# EAGLE design PiPowerRF (EAGLE 7.2.0)
CNAME: PiCrusts; CREVISION: 1.0; DESIGNER: Prajwal Bhattaram
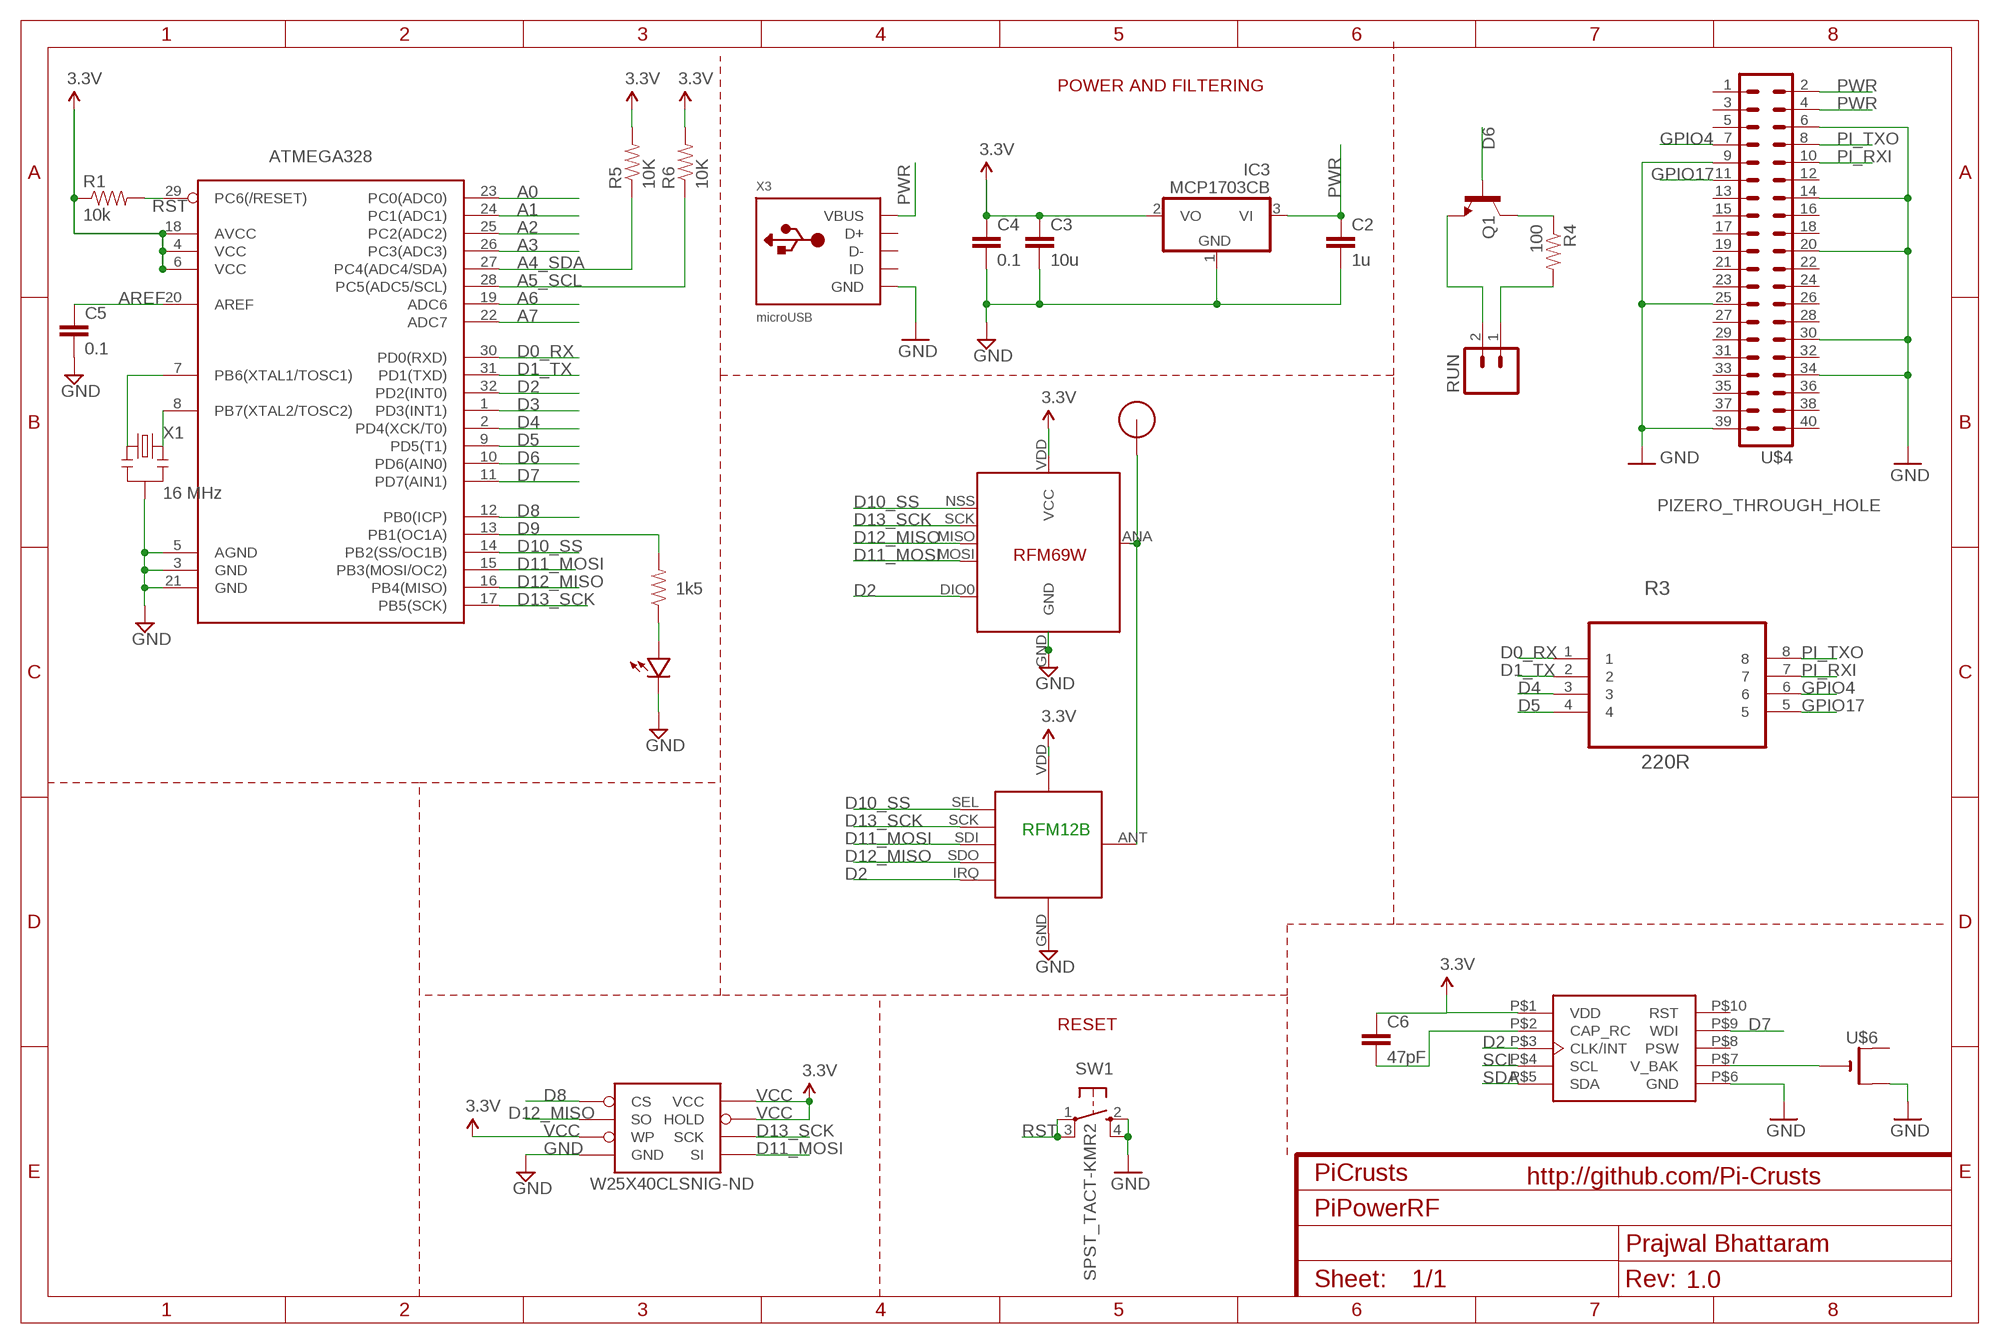
[diagram p0: schematic, sheet 1]

## Parts
ATMEGA328  ATMega-328  ATMEGA168/328TQFP32  [TQFP32-08]
C2  1u  CAP0603-CAP  [0603-CAP]
C3  10u  CAP0805-CAP  [0805-CAP]
C4  0.1  CAP0603-CAP  [0603-CAP]
C5  0.1  CAP0603-CAP  [0603-CAP]
C6  47pF  CAP0402-CAP  [0402-CAP]
IC3  MCP1703CB  [SOT23]
Q1  MMBT2222A  TRANSISTOR_NPNMMBT2222A  [SOT23-3]
R1  10k  RESISTOR0603-RES  [0603-RES]
R2  1k5  RESISTOR0603-RES  [0603-RES]
R3  220R  EXB38V221JV  [RESCAXE80P320X160X60-8N]
R4  100  RESISTOR0402-RES  [0402-RES]
R5  10K  RESISTOR0603  [0603-RES]
R6  10K  RESISTOR0603  [0603-RES]
RFM12B  RFM12B_MINPADS  [RFM12B-MINPADS]
RUN  M021X02_NO_SILK  [1X02_NO_SILK]
SW1  SPST_TACT-KMR2  [KMR2]
U$1  RFM12B_ANTENNA  [RFM12B-ANTENNA]
U$2  LED0603  [0603-LED]
U$4  PIZERO_THROUGH_HOLE  [PIZERO_THOUGH_HOLE]
U$5  RFM69  [RFM69W-MINPADS]
U$6  CR1220SMT  [CR1220-SMD]
W25X40CLSNIG-ND  AT25F512BWIDE_5.3MM  [SO08WIDE]
X1  16 MHz  RESONATORSMD  [RESONATOR-SMD]
X2  MC-RTC-RV-1805-C3-I2C  [MC-RTC-C3]
X3  microUSB  USB_MICRO_20329_V2  [4UCONN_20329_V2]

## Nets
A0: ATMEGA328.23(PC0(ADC0))
A1: ATMEGA328.24(PC1(ADC1))
A2: ATMEGA328.25(PC2(ADC2))
A3: ATMEGA328.26(PC3(ADC3))
A4_SDA: ATMEGA328.27(PC4(ADC4/SDA)) R5.1
A5_SCL: ATMEGA328.28(PC5(ADC5/SCL)) R6.1
A6: ATMEGA328.19(ADC6)
A7: ATMEGA328.22(ADC7)
AREF: ATMEGA328.20(AREF) C5.1
D0_RX: ATMEGA328.30(PD0(RXD)) R3.1
D1_TX: ATMEGA328.31(PD1(TXD)) R3.2
D2: ATMEGA328.32(PD2(INT0)) RFM12B.IRQ U$5.DIO0 X2.P$3(CLK/INT)
D3: ATMEGA328.1(PD3(INT1))
D4: ATMEGA328.2(PD4(XCK/T0)) R3.3
D5: ATMEGA328.9(PD5(T1)) R3.4
D6: ATMEGA328.10(PD6(AIN0)) Q1.1(B)
D7: ATMEGA328.11(PD7(AIN1)) X2.P$9(WDI)
D8: ATMEGA328.12(PB0(ICP)) W25X40CLSNIG-ND.1(CS)
D9: ATMEGA328.13(PB1(OC1A)) R2.2
D10_SS: ATMEGA328.14(PB2(SS/OC1B)) RFM12B.SEL U$5.NSS(SEL)
D11_MOSI: ATMEGA328.15(PB3(MOSI/OC2)) RFM12B.SDI(SDI/MOSI) U$5.MOSI W25X40CLSNIG-ND.5(SI)
D12_MISO: ATMEGA328.16(PB4(MISO)) RFM12B.SDO(SDO/MISO) U$5.MISO W25X40CLSNIG-ND.2(SO)
D13_SCK: ATMEGA328.17(PB5(SCK)) RFM12B.SCK U$5.SCK W25X40CLSNIG-ND.6(SCK)
GND [power]: ATMEGA328.3(GND) ATMEGA328.5(AGND) ATMEGA328.21(GND) C2.2 C3.2 C4.2 C5.2 IC3.1(GND) RFM12B.GND SW1.2(S) SW1.4(S1) U$2.MINUS U$4.6 U$4.9 U$4.14 U$4.20 U$4.25 U$4.30 U$4.34 U$4.39 U$5.GND U$6.+$2(+1) W25X40CLSNIG-ND.4(GND) X1.2 X2.P$6(GND) X3.BASE@1(GND) X3.BASE@2(GND) X3.GND X3.SPRT@1(GND) X3.SPRT@2(GND) X3.SPRT@3(GND) X3.SPRT@4(GND)
GPIO4: R3.6 U$4.7
GPIO17: R3.5 U$4.11
N$1: ATMEGA328.7(PB6(XTAL1/TOSC1)) X1.1
N$2: R2.1 U$2.PLUS
N$3: RFM12B.ANT U$1.P$1 U$5.ANA(ANT)
N$4: R4.2 RUN.1
N$5: Q1.2(E) RUN.2
N$6: U$6.- X2.P$7(V_BAK)
N$7: Q1.3(C) R4.1
N$8: C6.2 X2.P$2(CAP_RC)
N$21: ATMEGA328.8(PB7(XTAL2/TOSC2)) X1.3
PI_RXI: R3.7 U$4.10
PI_TXO: R3.8 U$4.8
PWR [power]: C2.1 IC3.3(VI) U$4.2 U$4.4 X3.VBUS
RST: ATMEGA328.29(PC6(/RESET)) R1.2 SW1.1(P) SW1.3(P1)
SCL: X2.P$4(SCL)
SDA: X2.P$5(SDA)
VCC: ATMEGA328.4(VCC) ATMEGA328.6(VCC) ATMEGA328.18(AVCC) C3.1 C4.1 C6.1 IC3.2(VO) R1.1 R5.2 R6.2 RFM12B.VDD U$5.VDD(VCC) W25X40CLSNIG-ND.3(WP) W25X40CLSNIG-ND.7(HOLD) W25X40CLSNIG-ND.8(VCC) X2.P$1(VDD) ; supply symbol labelled 3.3V
Unconnected: U$4.1 U$4.3 U$4.5 U$4.12 U$4.13 U$4.15 U$4.16 U$4.17 U$4.18 U$4.19 U$4.21 U$4.22 U$4.23 U$4.24 U$4.26 U$4.27 U$4.28 U$4.29 U$4.31 U$4.32 U$4.33 U$4.35 U$4.36 U$4.37 U$4.38 U$4.40 U$6.+$1(+) X2.P$8(PSW) X2.P$10(RST) X3.D+ X3.D- X3.ID

## Notes on the sheet
- POWER AND FILTERING
- RFM12B
- RESET
- http://github.com/Pi-Crusts

## Library data of the parts
ATMEGA328 = LowPowerLab:ATMEGA168/328: Atmel 32-pin 8-bit micro, 16k flash.
C2-C5 = LowPowerLab:CAP: Capacitor Standard 0603 ceramic capacitor, and 0.1" leaded capacitor.
C6 = SparkFun-Capacitors:CAP: Capacitor Standard 0603 ceramic capacitor, and 0.1" leaded capacitor.
IC3 = linear:MCP1703: 250 mA, 16V, Low Quiescent Current LDO Regulator Source: http://ww1.microchip.com/downloads/en/DeviceDoc/22049b.pdf
Q1 = SparkFun-DiscreteSemi:TRANSISTOR_NPN: Generic NPN BJT MMBT2222A - TRANS-08049 (SOT-23, 1A 40V) MPSA42 - TRANS-09116 (SOT-23, 500mA 300V) MMBT5088LT1G - TRANS-11160 (SOT-23, 50 mA 30V); PROD_ID: TRANS-08049
R1 R2 = LowPowerLab:RESISTOR: Resistor Basic schematic elements and footprints for 0603, 1206, and PTH resistors.
R3 = Panasonic-EXB-ERJ:EXB38V: Chip Resistor Array; MPN: EXB38V221JV; OC_FARNELL: 2060094; OC_NEWARK: 65T9093; PACKAGE: 0603; POWERRATING: 0.063 W/element; SUPPLIER: PANASONIC; TOLERANCE: ±5 %
R4 = SparkFun-Passives:RESISTOR: Resistor Basic schematic elements and footprints for 0603, 1206, and PTH resistors.
R5 R6 = SparkFun-Resistors:RESISTOR: Resistor Basic schematic elements and footprints for 0603, 1206, and PTH resistors.
RFM12B = LowPowerLab:RFM12B_MINPADS
RUN = SparkFun-Connectors:M02: Standard 2-pin 0.1" header. Use with - straight break away headers ( PRT-00116) - right angle break away headers (PRT-00553) - swiss pins (PRT-00743) - machine pins (PRT-00117) - female headers (PRT-00115) Molex polarized connector foot print use with: PRT-08233 with associated crimp pins and housings. 2.54_SCREWTERM for use with PRT-10571. 3.5mm Screw Terminal footprints for PRT-08084 5mm Screw Terminal footprints for use with PRT-08433
SW1 = adafruit:SPST_TACT: SMT 6mm switch, EVQQ2 series http://www.ladyada.net/library/eagle
U$1 = LowPowerLab:RFM12B_ANTENNA
U$2 = LowPowerLab:LED
U$4 = pizero:PIZERO_THROUGH_HOLE
U$5 = LowPowerLab:RFM69
U$6 = adafruit:CR1220: CR1216/CR1220/CR1225 12mm 3V lithium coin cell Great for battery packup. Both SMT and THM holders. Note the THM package has the ground pads on both sides of the PCB so that the masks are the same - this reduces the cost
W25X40CLSNIG-ND = LowPowerLab:AT25F512B: 4-Mbit SPI flash memory
X1 = SparkFun:RESONATOR: Resonator Small SMD resonator. This is the itty bitty 10/20MHz resonators with built in caps. CSTCE10M0G55 and CSTCE20M0V53. Footprint has been reviewed closely but hasn't been tested yet.
X2 = Microcrystal-RTC:MC-RTC-RV-1805-C3-I2C: MicroCrystal RV-1805-C3 Extreme Low Power RTC Module Extreme Low Current consumption XTAL-Mode 60nA RC-Mode 17nA RC Autocalibrated Mode 22nA Factory calibrated Time accuracy typ. ±2.0ppm @ 25°C Miniature SMT ceramic package with integrated Quartz Crystal for best Noise & EMI Immunity Automatic Battery Switchover, Trickle Charger, Power Management & Power Switch Function Programmable CLKOUT frequencies I2C Bus Interface (fast mode 400kHz) Time keeping mode down to 1.5 V Programmable Alarm, Timer and INT 512 Bytes of User RAM
X3 = microbuilder:USB: USB Connectors USBMINIB - Surface Mount Female Mini-B USB Connector 4UConnector: 06564

## Net classes
1 power: width 0.381 mm, clearance 0.254 mm

## Board
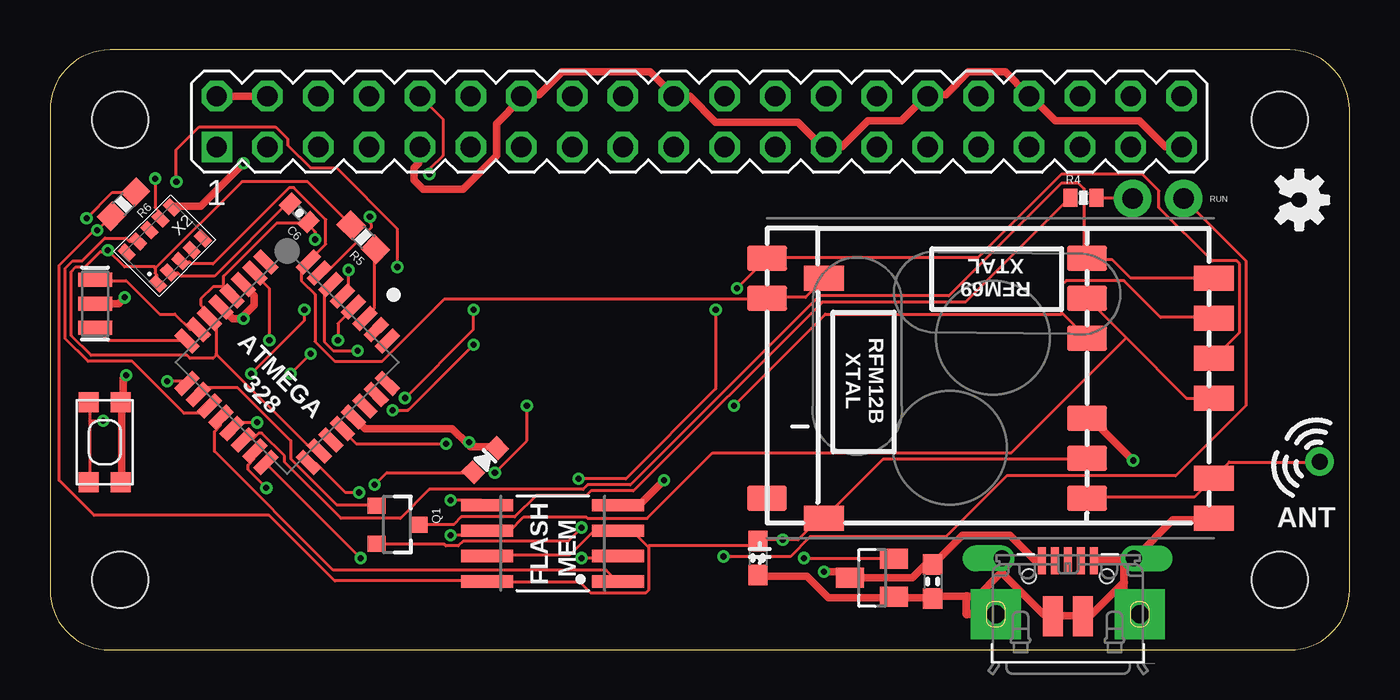
[diagram p1: board, top side]
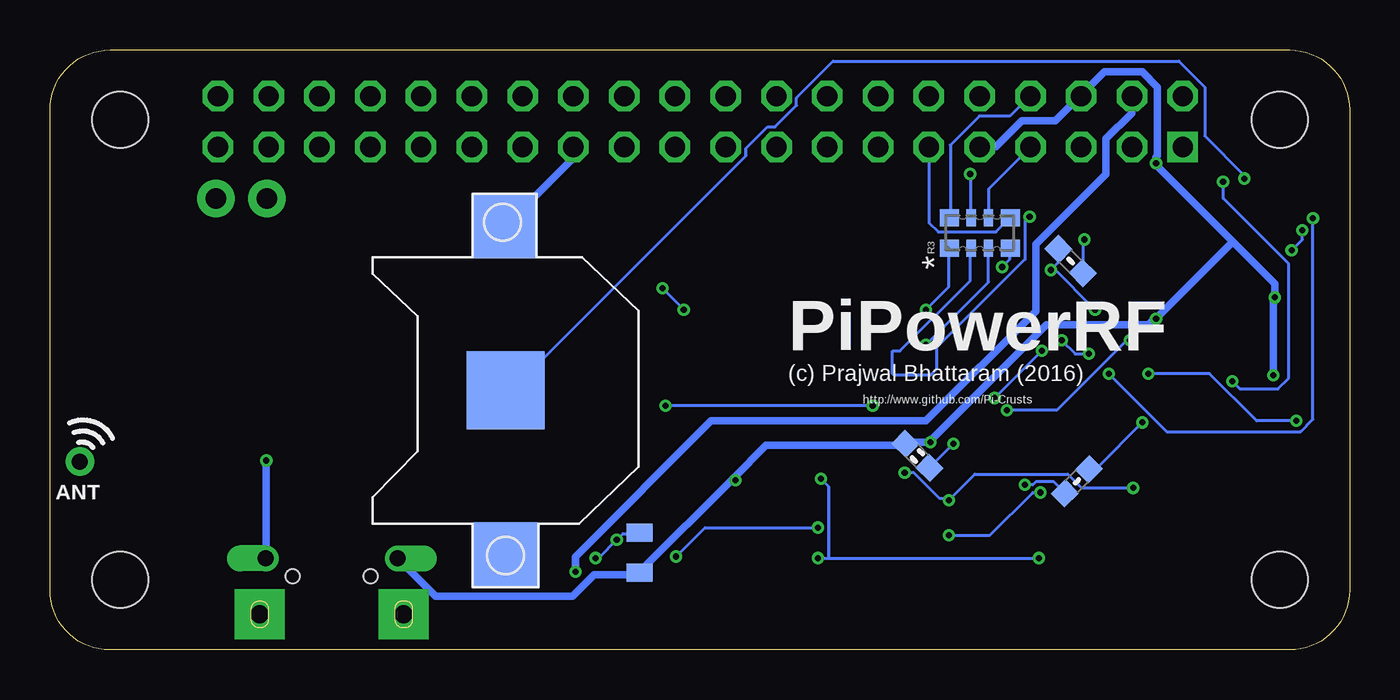
[diagram p2: board, bottom side, seen from below]

Size 65 x 30 mm. Coordinates in mm from the lower left corner, seen from the top.
Copper layers (1*16): Top 0.035mm / dielectric 1.5mm / Bottom 0.035mm
Design rules "ITEADstudio_DRC *": minimum track width 6mil, minimum drill 12mil, track to track 6mil, track to pad 6mil, pad to pad 6mil, via to via 6mil, smd to smd 0mil, copper to edge 10mil, drill to drill 10mil, minimum pad ring 10mil, minimum via ring 6mil, stop-mask expansion 2mil, vias tented up to drill 100mil, thermal gap 15mil
tRestrict: area 24.2,8.9 to 29,12.9; area 5.8,16.9 to 6.8,18.6; area 5.1,9.7 to 6.7,10.4
bRestrict: area 27.4,17.7 to 29.1,18.7; area 21,13.9 to 22.8,14.9; area 21.5,12.6 to 22,13.2; area 20.6,12.6 to 21.1,13.2; area 20.1,12.9 to 20.6,13.5; area 20,13.4 to 20.5,14.1; area 26.5,18.9 to 27,19.5; area 26.5,17.9 to 27,18.5; area 27.5,19.2 to 28,19.8; area 27.9,18.8 to 29,19.6

### Footprints (pad centres in the part's own frame; a part is rotated, then mirrored left to right if it is on the bottom)
TQFP32-08 = smd 1.27 x 0.533: 1 -4.293,2.8; 2 -4.293,2; 3 -4.293,1.2; 4 -4.293,0.4; 5 -4.293,-0.4; 6 -4.293,-1.2; 7 -4.293,-2; 8 -4.293,-2.8; 17 4.293,-2.8; 18 4.293,-2; 19 4.293,-1.2; 20 4.293,-0.4; 21 4.293,0.4; 22 4.293,1.2; 23 4.293,2; 24 4.293,2.8 | smd 0.533 x 1.27: 9 -2.8,-4.293; 10 -2,-4.293; 11 -1.2,-4.293; 12 -0.4,-4.293; 13 0.4,-4.293; 14 1.2,-4.293; 15 2,-4.293; 16 2.8,-4.293; 25 2.8,4.293; 26 2,4.293; 27 1.2,4.293; 28 0.4,4.293; 29 -0.4,4.293; 30 -1.2,4.293; 31 -2,4.293; 32 -2.8,4.293
0603-CAP = smd 1.016 x 0.965: 1 -0.85,0; 2 0.85,0
0805-CAP = smd 0.902 x 1.3: 1 -1,0; 2 1,0
0402-CAP = smd 0.7 x 0.9: 1 -0.65,0; 2 0.65,0
SOT23 = smd 1 x 1.4: 1 -0.95,-1.1; 2 0.95,-1.1; 3 0,1.1
SOT23-3 = smd 0.8 x 0.9: 1 -0.95,-1; 2 0.95,-1; 3 0,1.1
0603-RES = smd 1.016 x 0.965: 1 -0.85,0; 2 0.85,0
RESCAXE80P320X160X60-8N = smd 0.864 x 0.965: 1 -0.762,1.524; 4 -0.762,-1.524; 5 0.762,-1.524; 8 0.762,1.524 | smd 0.864 x 0.457: 2 -0.762,0.432; 3 -0.762,-0.432; 6 0.762,-0.432; 7 0.762,0.432
0402-RES = smd 0.7 x 0.9: 1 -0.65,0; 2 0.65,0
0603-RES' = smd 1.1 x 1: 1 -0.85,0; 2 0.85,0
RFM12B-MINPADS = smd 2 x 1.27: ANT 8,-6; GND 8,-2; IRQ -8,4; SCK 8,4; SDI 8,2; SDI1 -8.002,-6.001; SDO -8,6; SEL 8,6; VDD 8,-4
1X02_NO_SILK = drill 1.016 pad 1.88: 1 0,0; 2 2.54,0
KMR2 = smd 1 x 1: 1 2,0.8; 2 2,-0.8; 3 -2,0.8; 4 -2,-0.8
RFM12B-ANTENNA = drill 0.8 pad 1.422: P$1 0,0
0603-LED = smd 0.8 x 0.9: MINUS -0.85,0; PLUS 0.85,0
PIZERO_THOUGH_HOLE = drill 1.016 square: 1 8.34,25.15 | drill 1.016 octagon: 2 8.34,27.69; 3 10.88,25.15; 4 10.88,27.69; 5 13.42,25.15; 6 13.42,27.69; 7 15.96,25.15; 8 15.96,27.69; 9 18.5,25.15; 10 18.5,27.69; 11 21.04,25.15; 12 21.04,27.69; 13 23.58,25.15; 14 23.58,27.69; 15 26.12,25.15; 16 26.12,27.69; 17 28.66,25.15; 18 28.66,27.69; 19 31.2,25.15; 20 31.2,27.69; 21 33.74,25.15; 22 33.74,27.69; 23 36.28,25.15; 24 36.28,27.69; 25 38.82,25.15; 26 38.82,27.69; 27 41.36,25.15; 28 41.36,27.69; 29 43.9,25.15; 30 43.9,27.69; 31 46.44,25.15; 32 46.44,27.69; 33 48.98,25.15; 34 48.98,27.69; 35 51.52,25.15; 36 51.52,27.69; 37 54.06,25.15; 38 54.06,27.69; 39 56.6,25.15; 40 56.6,27.69 | hole 2.8: 3.5,3.5; 3.5,26.5; 61.5,26.5; 61.5,3.5
RFM69W-MINPADS = smd 2 x 1.27: ANA 8,-5; DIO0 -11.5,5; GND 8,-7; MISO 8,1; MOSI 8,3; NSS 8,5; SCK 8,-1; VDD -11.5,-7
CR1220-SMD = smd 3.2 x 3.2: +$1 -8.2,0; +$2 8.2,0 | smd 3.9 x 3.9: - 0,0
SO08WIDE = smd 0.61 x 2.6: 1 -1.905,-3.269; 2 -0.635,-3.269; 3 0.635,-3.269; 4 1.905,-3.269; 5 1.905,3.286; 6 0.635,3.286; 7 -0.635,3.286; 8 -1.905,3.286
RESONATOR-SMD = smd 0.7 x 1.7: 1 -1.2,0; 2 0,0; 3 1.2,0
MC-RTC-C3 = smd 0.5 x 0.8: P$1 -1.6,-1.1; P$2 -0.8,-1.1; P$3 0,-1.1; P$4 0.8,-1.1; P$5 1.6,-1.1; P$6 1.6,1.1; P$7 0.8,1.1; P$8 0,1.1; P$9 -0.8,1.1; P$10 -1.6,1.1
4UCONN_20329_V2 = smd 1 x 2: BASE@1 -0.75,-2; BASE@2 0.75,-2 | smd 0.4 x 1.35: D+ 0,0.775; D- -0.65,0.775; GND 1.3,0.775; ID 0.65,0.775; VBUS -1.3,0.775 | drill 0.8 pad 1.2 offset: SPRT@1 -3.3,0.9; SPRT@2 3.3,0.9 | drill 0.9 pad 2.5 square: SPRT@3 -3.6,-1.9; SPRT@4 3.6,-1.9 | hole 0.7: -1.95,0; 1.95,0

### Placement (x,y rotation side)
ATMEGA328  11.86,14.39 315 top
C2  44.15,3.43 270 top
C3  35.51,4.85 270 bottom
C4  35.41,4.6 270 top
C5  21.62,9.7 135 bottom
C6  12.47,21.85 135 top
IC3  41.12,3.61 90 top
Q1  17.35,6.27 270 top
R1  13.95,19.45 135 bottom
R2  13.64,8.43 45 bottom
R3  18.49,20.85 90 bottom
R4  51.69,22.61 0 top
R5  10K  [0603-RES']  15.67,20.64 135 top
R6  10K  [0603-RES']  3.68,22.29 225 top
RFM12B  43.87,13.59 0 top
RUN  54.15,22.58 0 top
SW1  2.74,10.39 90 top
U$1  63.51,9.42 340 bottom
U$2  21.77,9.5 225 top
U$3  [OSHW-LOGO-S]  62.48,22.5 270 top
U$4  0,0 0 top
U$5  50.22,13.59 0 top
U$6  42.21,12.98 90 bottom
W25X40CLSNIG-ND  25.15,5.33 90 top
X1  2.26,17.32 270 top
X2  5.74,20.22 45 top
X3  50.9,3.68 0 top

### Tracks (layer width: path | path; a pad name or v marks a point on that pad's centre or on a via)
A4_SDA
  Top 0.152: R5.1 16.23,19.99 16.23,17.09 15.77,16.64 ATMEGA328.27
A5_SCL  (via drill 0.3)
  Top 0.152: v1.83,21.59 3.12,22.89 R6.1 | v13.03,14.81 v12.04,13.82 | v14.4,15.49 14.4,16.33 15.16,17.09 ATMEGA328.28
  Bottom 0.152: v1.83,21.59 1.83,11.53 2.44,10.92 9.14,10.92 v12.04,13.82 | v13.03,14.81 13.72,14.81 v14.4,15.49
AREF  (via drill 0.3)
  Top 0.152: v19.81,10.31 15.32,10.31 14.63,11 ATMEGA328.20
  Bottom 0.152: v19.81,10.31 20.95,9.17 C5.1
D0_RX  (via drill 0.3)
  Top 0.152: v21.18,17.02 21.18,16.03 v17.75,12.6 | v15.39,14.96 14.17,14.96 13.72,15.42 13.72,17.93 14.02,18.24 ATMEGA328.30
  Bottom 0.152: v21.18,17.02 20.04,18.16 20.04,20.07 R3.1 | v15.39,14.96 v17.75,12.6
D1_TX  (via drill 0.3)
  Top 0.152: v16,21.67 16,21.36 16.08,21.29 16.08,21.13 13.79,18.85 ATMEGA328.31
  Bottom 0.152: v16,21.67 16.23,21.44 16.23,19.53 20.65,15.11 20.65,14.05 20.95,13.74 22.78,13.74 22.86,13.82 22.86,14.96 22.48,14.96 18.97,18.47 18.97,20.07 R3.2
D2
  Top 0.152: U$5.DIO0 38.71,18.54 37.79,17.63 35.89,17.63 RFM12B.IRQ 35.81,17.55 19.74,17.55 16.61,14.43 14.25,14.43 13.26,15.42 13.26,17.78 12.57,18.47 12.57,19.08 12.88,19.38 ATMEGA328.32 12.95,19.46 13.79,20.29 13.79,21.51 12.19,23.11 11.96,23.11 8.15,19.3 7.09,19.3 7.01,19.38 6.55,19.38 X2.P$3
D4  (via drill 0.3)
  Top 0.152: v21.18,15.27 17.91,11.99 v17.14,11.99 | v10.97,15.49 10.97,18.08 10.29,18.77 ATMEGA328.2
  Bottom 0.152: R3.3 18.06,18.39 v21.18,15.27 | v17.14,11.99 14.63,11.99 11.12,15.49 v10.97,15.49
D5  (via drill 0.3)
  Top 0.152: v17.37,19.15 17.37,21.06 14.33,24.1 13.03,24.1 11.89,25.25 11.89,25.55 11.28,26.16 7.47,26.16 6.32,25.02 v6.32,23.42 | v5.87,13.44 6.71,13.44 6.78,13.36 ATMEGA328.9
  Bottom 0.152: v17.37,19.15 16.99,19.53 16.99,20.07 R3.4 | v6.32,23.42 6.32,22.58 3.05,19.3 3.05,13.59 3.58,13.06 5.49,13.06 v5.87,13.44
D6
  Top 0.152: Q1.1 16.31,7.26 14.33,7.26 12.04,9.55 12.04,10.46 9.37,13.13 7.77,13.13 7.47,12.83 ATMEGA328.10
D7
  Top 0.152: X2.P$9 4.34,20.45 3.96,20.45 3.81,20.6 2.74,20.6 1.6,19.46 1.14,19.46 0.76,19.08 0.76,15.57 1.9,14.43 4.11,14.43 6.71,11.84 7.62,11.84 7.92,12.14 ATMEGA328.11
D8
  Top 0.152: ATMEGA328.12 8.53,11.61 8.53,11.23 8.23,10.92 8.23,9.93 14.17,3.99 27.81,3.99 28.35,3.45 W25X40CLSNIG-ND.1
D9  (via drill 0.3)
  Top 0.152: v10.36,11.38 9.45,11.38 9.14,11.07 ATMEGA328.13
  Bottom 0.152: v10.36,11.38 12.65,9.09 13.03,9.09 R2.2
D10_SS
  Top 0.152: ATMEGA328.14 9.68,10.54 10.13,10.54 10.44,10.85 10.59,10.85 11.73,9.7 11.73,9.4 14.55,6.58 17.53,6.58 18.97,8.03 26.67,8.03 26.9,8.26 29.03,8.26 38.48,17.7 44.96,17.7 50.6,23.34 51.43,23.34 51.74,23.04 51.74,19.69 51.82,19.61 RFM12B.SEL 51.89,19.53 53.11,19.53 54.03,18.62 58.14,18.62 U$5.NSS
D11_MOSI  (via drill 0.3)
  Top 0.152: 50.63,16.83 50.6,16.87 50.6,18.24 50.83,18.47 53.72,18.47 55.55,16.64 58.14,16.64 U$5.MOSI | 50.63,16.83 51.82,15.65 RFM12B.SDI | v10.82,8.1 9.91,9.02 9.91,9.25 10.21,9.55 10.21,9.93 ATMEGA328.15 | v20.04,7.49 21.56,7.49 21.79,7.26 W25X40CLSNIG-ND.5 | v34.21,12.22 38.79,16.79 50.6,16.79 50.63,16.83 | v23.85,12.22 23.85,10.46 v22.25,8.86
  Bottom 0.152: v10.82,8.1 13.41,8.1 14.1,8.79 18.74,8.79 v20.04,7.49 20.04,7.57 20.5,7.57 21.79,8.86 v22.25,8.86 | v23.85,12.22 v34.21,12.22
D12_MISO  (via drill 0.3)
  Top 0.152: v15.54,4.6 10.82,9.32 ATMEGA328.16 | v26.59,4.6 28.27,4.6 28.35,4.67 W25X40CLSNIG-ND.2 | U$5.MISO 59.51,15.88 59.51,19.3 59.36,19.46 58.14,19.46 55.47,22.12 55.47,22.96 54.64,23.8 50.6,23.8 46.41,19.61 35.89,19.61 RFM12B.SDO 35.81,19.53 v34.37,18.08 | v26.44,8.56 28.8,8.56 33.3,13.06 v33.3,17.02
  Bottom 0.152: v26.59,4.6 26.06,4.6 | 26.06,4.6 v15.54,4.6 | 26.06,4.6 26.06,8.18 v26.44,8.56 | v34.37,18.08 v33.3,17.02
D13_SCK  (via drill 0.3)
  Top 0.152: 53.83,15.61 51.89,17.55 RFM12B.SCK | 53.83,15.61 56.84,12.6 58.14,12.6 U$5.SCK | v15.47,7.87 14.78,7.87 13.33,9.32 12.95,9.32 ATMEGA328.17 | v20.04,5.74 21.56,5.74 21.79,5.97 W25X40CLSNIG-ND.6 23.01,5.97 23.7,6.65 26.82,6.65 26.9,6.58 29.87,6.58 33.15,9.86 48.08,9.86 53.83,15.61
  Bottom 0.152: v15.47,7.87 15.85,7.87 17.98,5.74 v20.04,5.74
GND  (via drill 0.3)
  Top 0.381: 20.88,10.31 20.12,11.07 15.77,11.07 15.24,11.61 ATMEGA328.21 | 20.88,10.31 21.03,10.16 22.33,10.16 U$2.MINUS | v30.71,8.48 29.49,7.26 28.42,7.26 W25X40CLSNIG-ND.4 | v20.95,10.39 20.88,10.31 | C4.2 35.43,3.68 37.87,3.68 38.94,2.62 42.21,2.62 IC3.1 42.37,2.62 44.12,2.62 C2.2 44.27,2.69 45.85,2.69 46.41,2.69 47.47,3.76 47.62,3.84 | U$5.GND 58.06,6.5 56.16,6.5 54.33,4.67 X3.SPRT@2 | X3.GND 52.27,4.52 54.18,4.52 X3.SPRT@2 | v54.18,9.47 52.12,11.53 51.89,11.53 RFM12B.GND | X3.SPRT@2 53.72,4.37 53.72,3.38 52.12,1.78 51.82,1.78 X3.BASE@2 51.59,1.7 50.22,1.7 X3.BASE@1 49.99,1.78 49.68,1.78 47.62,3.84 | 47.62,3.84 47.62,4.52 X3.SPRT@1 | SW1.4 3.58,8.41 3.58,12.37 SW1.2 3.66,12.52 3.66,13.59 v3.81,13.74 | 9.52,16.56 9.14,16.56 8.61,17.09 ATMEGA328.5 | 9.52,16.56 10.21,17.25 10.21,17.7 9.68,18.24 ATMEGA328.3 | v9.68,24.33 7.54,22.2 6.17,22.2 X2.P$6 | X1.2 3.43,17.32 v3.73,17.63 | v9.68,16.56 9.52,16.56 | U$4.39 56.54,25.17 55.78,25.17 54.48,26.47 50.29,26.47 49.15,27.61 U$4.34 48.92,27.76 47.78,28.91 45.95,28.91 44.81,27.76 43.97,27.76 U$4.30 43.74,27.61 42.6,26.47 40.92,26.47 39.62,25.17 38.86,25.17 U$4.25 38.63,25.17 37.41,26.39 33.3,26.39 32,27.69 31.39,27.69 U$4.20 31.17,27.76 30.02,28.91 25.6,28.91 24.46,27.76 23.62,27.76 U$4.14 23.55,27.53 22.33,26.31 22.33,24.71 20.65,23.04 18.67,23.04 18.21,23.5 18.21,24.1 18.44,24.33 18.44,25.1 U$4.9
  Top 0.406: X3.SPRT@3 45.85,1.78 45.85,2.69 | X3.SPRT@4 53.72,1.78 53.72,3.38
  Bottom 0.381: 30.82,8.6 35.51,3.91 C3.2 35.66,3.76 37.79,3.76 38.86,2.69 45.72,2.69 47.55,4.52 X3.SPRT@1 | 30.82,8.6 29.18,10.24 22.25,10.24 C5.2 22.1,10.39 v20.95,10.39 20.88,10.54 15.16,16.26 10.06,16.26 9.83,16.48 v9.68,16.56 5.83,20.41 | v30.71,8.48 30.82,8.6 | v54.18,9.47 54.18,4.6 X3.SPRT@2 | 5.83,20.41 9.6,24.18 v9.68,24.33 9.68,24.64 9.6,24.71 9.6,28.14 10.36,28.91 12.27,28.91 13.41,27.76 U$4.6 13.56,27.61 14.71,26.47 16.38,26.47 17.68,25.17 18.44,25.17 U$4.9 | 5.83,20.41 3.73,18.31 v3.73,17.63 3.81,17.48 v3.81,13.74 | U$4.25 38.86,25.1 38.86,24.56 42.21,21.21 U$6.+$2
GPIO4
  Bottom 0.152: R3.6 18.06,23.04 16,25.1 U$4.7
GPIO17
  Bottom 0.152: R3.5 17.68,20.9 20.57,20.9 21.03,21.36 21.03,25.1 U$4.11
N$1
  Top 0.152: ATMEGA328.7 7.39,16.03 7.01,16.03 6.25,16.79 5.49,16.79 3.81,18.47 2.29,18.47 X1.1
N$2  (via drill 0.3)
  Top 0.152: v16.23,8.26 16.84,8.86 21.11,8.86 U$2.PLUS
  Bottom 0.152: v16.23,8.26 15.85,8.26 15.7,8.41 14.78,8.41 14.25,7.87 R2.1
N$3
  Top 0.152: RFM12B.ANT 51.89,7.65 57.23,7.65 58.14,8.56 U$5.ANA 58.22,8.64 58.98,9.4 63.47,9.4 U$1.P$1
N$4
  Top 0.152: RUN.1 52.35,22.58 R4.2
N$5  (via drill 0.3)
  Top 0.152: v26.59,6.12 25.91,5.44 20.65,5.44 20.42,5.21 19.81,5.21 19.74,5.28 16.38,5.28 Q1.2 | v33.68,4.67 37.03,4.67 38.02,5.66 44.81,5.66 47.85,8.71 56.31,8.71 59.82,12.22 59.82,19.46 RUN.2
  Bottom 0.152: v26.59,6.12 32.23,6.12 v33.68,4.67
N$6  (via drill 0.3)
  Top 0.152: v5.26,23.57 5.26,22.12 5.49,21.89 5.49,21.59 X2.P$7
  Bottom 0.152: v5.26,23.57 5.26,23.72 7.24,25.7 7.24,28.14 8.53,29.44 25.83,29.44 27.66,27.61 27.66,27.23 28.73,26.16 29.11,26.16 30.17,25.1 30.17,24.71 41.91,12.98 U$6.-
N$7
  Top 0.152: Q1.3 20.19,6.27 20.57,6.65 23.24,6.65 24.31,7.72 26.82,7.72 27.05,7.95 29.18,7.95 38.63,17.4 45.8,17.4 50.98,22.58 R4.1
N$8
  Top 0.152: X2.P$2 6.02,18.85 6.4,18.85 6.55,18.69 8.23,18.69 11.81,22.28 11.96,22.28 C6.2
N$21
  Top 0.152: ATMEGA328.8 6.78,15.49 2.9,15.49 2.29,16.1 X1.3
PI_RXI  (via drill 0.3)
  Top 0.152: v18.97,23.8 18.97,24.03 19.66,24.71 19.66,26.54 18.52,27.69 U$4.10
  Bottom 0.152: v18.97,23.8 18.97,21.67 R3.7
PI_TXO
  Bottom 0.152: R3.8 19.96,21.67 19.96,25.25 18.52,26.7 16.99,26.7 16,27.69 U$4.8
PWR  (via drill 0.3)
  Top 0.381: U$4.2 8.38,27.69 10.82,27.69 U$4.4 | X3.VBUS 49.53,4.52 49.22,4.52 48.01,5.74 45.64,5.74 44.27,4.37 C2.1 44.12,4.22 43.74,4.22 43.13,3.61 IC3.3 39.85,3.68 39.62,3.91 v38.71,3.91
  Bottom 0.381: v38.71,3.91 38.71,4.67 31.93,11.46 21.18,11.46 15.7,16.94 15.7,20.29 12.19,23.8 12.19,25.55 10.9,26.85 10.9,27.69 U$4.4
RST  (via drill 0.3)
  Top 0.152: v14.93,19 14.93,18.08 14.63,17.78 ATMEGA328.29 | 1.98,11.46 1.98,12.37 SW1.1 | 1.98,11.46 1.98,8.41 SW1.3 | v12.73,17.02 12.73,16.48 v10.06,13.82 | 1.98,11.46 v2.67,11.46
  Bottom 0.152: R1.2 14.55,19.99 14.55,19.38 v14.93,19 14.78,19.08 v12.73,17.02 | v10.06,13.82 7.01,13.82 4.65,11.46 v2.67,11.46
VCC  (via drill 0.3)
  Top 0.152: 5.3,19.11 9.6,23.42 12.88,23.42 15.01,21.29 R5.2 | 5.3,19.11 5.26,19.08 5.26,18.85 5.33,18.77 5.33,18.31 X2.P$1 | R6.2 3.05,21.67 v2.36,20.98 2.21,20.98 0.46,19.23 0.46,8.48 2.21,6.73 10.97,6.73 14.25,3.45 21.79,3.45 W25X40CLSNIG-ND.8 21.87,3.38 26.52,3.38 27.05,2.84 29.79,2.84 29.95,3 29.95,5.13 29.91,5.17 | 5.3,19.11 5.26,19.15 3.73,19.15 v2.9,19.99 2.9,19.91 2.51,19.91 1.75,19.15 1.3,19.15 1.07,18.92 1.07,15.72 2.06,14.73 6.86,14.73 7.01,14.58 8.15,14.58 8.34,14.77 | 8.69,18.16 8.69,18.69 11.35,21.36 12.88,21.36 C6.1 12.88,21.29 13.26,20.9 v13.26,20.52 | 8.69,18.16 9.07,17.78 ATMEGA328.4 8.69,18.16 | 8.69,18.16 8.15,18.16 7.54,17.55 7.54,17.25 7.92,16.87 7.92,16.64 ATMEGA328.6 8,16.56 8.31,16.26 8.31,14.81 8.34,14.77 | 8.34,14.77 13.11,10.01 13.41,10.01 ATMEGA328.18 | 29.91,5.17 29.11,5.97 W25X40CLSNIG-ND.3 27.2,5.97 25.98,4.75 21.87,4.75 W25X40CLSNIG-ND.7 | v37.72,4.6 42.21,4.6 IC3.2 | RFM12B.VDD 51.82,9.55 41.68,9.55 38.79,6.65 U$5.VDD 38.48,6.58 37.41,5.51 v36.65,5.51 35.43,5.51 C4.1 35.36,5.44 35.13,5.21 29.95,5.21 29.91,5.17
  Bottom 0.152: v2.36,20.98 2.36,20.52 v2.9,19.99 | v13.26,20.52 13.33,20.45 13.33,18.92 R1.1 | C3.1 35.51,5.82 36.35,5.82 v36.65,5.51 37.57,4.6 v37.72,4.6

### Text on the board
tPlace: RFM69 / XTAL | RFM12B / XTAL
tDocu: REG
_tsilk: ATMEGA / 328 | FLASH | MEM | ANT
_bsilk: PiPowerRF | (c) Prajwal Bhattaram (2016) | http://www.github.com/Pi-Crusts | ANT